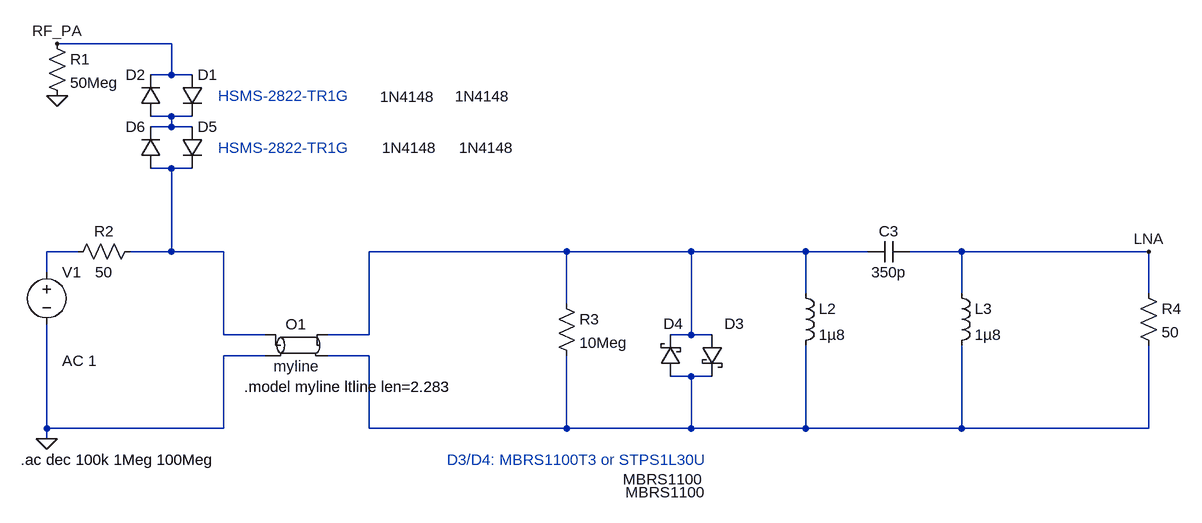
[diagram p0: schematic 22MHz Passive Switch with qL Cable.asc]
22MHz Passive Switch with qL Cable.asc, the LTspice schematic file:
Version 4
SHEET 1 1352 772
WIRE -208 -176 -384 -176
WIRE -208 -128 -208 -176
WIRE -208 -128 -240 -128
WIRE -176 -128 -208 -128
WIRE -208 -64 -240 -64
WIRE -176 -64 -208 -64
WIRE -208 -48 -208 -64
WIRE -208 -48 -240 -48
WIRE -176 -48 -208 -48
WIRE -208 16 -240 16
WIRE -176 16 -208 16
WIRE -352 144 -400 144
WIRE -208 144 -208 16
WIRE -208 144 -272 144
WIRE -128 144 -208 144
WIRE 400 144 96 144
WIRE 592 144 400 144
WIRE 768 144 592 144
WIRE 864 144 768 144
WIRE 1008 144 928 144
WIRE 1296 144 1008 144
WIRE -400 176 -400 144
WIRE 768 208 768 144
WIRE 1008 208 1008 144
WIRE 1296 208 1296 144
WIRE 400 224 400 144
WIRE -128 272 -128 144
WIRE -64 272 -128 272
WIRE 96 272 96 144
WIRE 96 272 32 272
WIRE 592 272 592 144
WIRE 592 272 560 272
WIRE 624 272 592 272
WIRE -64 304 -128 304
WIRE 96 304 32 304
WIRE 592 336 560 336
WIRE 624 336 592 336
WIRE -400 416 -400 256
WIRE -128 416 -128 304
WIRE -128 416 -400 416
WIRE 96 416 96 304
WIRE 400 416 400 304
WIRE 400 416 96 416
WIRE 592 416 592 336
WIRE 592 416 400 416
WIRE 768 416 768 288
WIRE 768 416 592 416
WIRE 1008 416 1008 288
WIRE 1008 416 768 416
WIRE 1296 416 1296 288
WIRE 1296 416 1008 416
WIRE -400 432 -400 416
FLAG -400 432 0
FLAG -384 -176 RF_PA
FLAG -384 -96 0
FLAG 1296 144 LNA
SYMBOL voltage -400 160 R0
WINDOW 123 24 152 Left 2
WINDOW 39 24 124 Left 2
SYMATTR Value2 AC 1
SYMATTR InstName V1
SYMATTR Value ""
SYMBOL res -256 128 R90
WINDOW 0 0 56 VBottom 2
WINDOW 3 32 56 VTop 2
SYMATTR InstName R2
SYMATTR Value 50
SYMBOL res 384 208 R0
SYMATTR InstName R3
SYMATTR Value 10Meg
SYMBOL diode -192 -128 R0
WINDOW 3 305 34 Left 2
SYMATTR Value 1N4148
SYMATTR InstName D1
SYMATTR Description Schottky diode
SYMATTR Type schottky
SYMBOL diode -224 -64 R180
WINDOW 0 24 64 Left 2
WINDOW 3 -537 31 Left 2
SYMATTR InstName D2
SYMATTR Value 1N4148
SYMATTR Description Schottky diode
SYMATTR Type schottky
SYMBOL res -400 -192 R0
SYMATTR InstName R1
SYMATTR Value 50Meg
SYMBOL schottky 608 272 R0
WINDOW 0 35 -17 Left 2
WINDOW 3 -121 222 Left 2
SYMATTR InstName D3
SYMATTR Value MBRS1100
SYMBOL schottky 576 336 R180
WINDOW 0 -4 81 Left 2
WINDOW 3 -38 -178 Left 2
SYMATTR InstName D4
SYMATTR Value MBRS1100
SYMBOL ind 752 192 R0
SYMATTR InstName L2
SYMATTR Value 1µ8
SYMATTR SpiceLine Rser=0.3
SYMBOL ind 992 192 R0
SYMATTR InstName L3
SYMATTR Value 1µ8
SYMATTR SpiceLine Rser=0.3
SYMBOL cap 864 160 R270
WINDOW 0 32 32 VTop 2
WINDOW 3 0 32 VBottom 2
SYMATTR InstName C3
SYMATTR Value 350p
SYMATTR SpiceLine Rser=0.1
SYMBOL res 1280 192 R0
SYMATTR InstName R4
SYMATTR Value 50
SYMBOL diode -192 -48 R0
WINDOW 3 308 32 Left 2
SYMATTR Value 1N4148
SYMATTR InstName D5
SYMATTR Description Schottky diode
SYMATTR Type schottky
SYMBOL diode -224 16 R180
WINDOW 0 24 64 Left 2
WINDOW 3 -543 32 Left 2
SYMATTR InstName D6
SYMATTR Value 1N4148
SYMATTR Description Schottky diode
SYMATTR Type schottky
SYMBOL ltline -16 288 R0
SYMATTR InstName O1
SYMATTR Value myline
TEXT -440 464 Left 2 !.ac dec 100k 1Meg 100Meg
TEXT -136 -96 Left 2 ;HSMS-2822-TR1G
TEXT -136 -16 Left 2 ;HSMS-2822-TR1G
TEXT 216 464 Left 2 ;D3/D4: MBRS1100T3 or STPS1L30U
TEXT -96 352 Left 2 !.model myline ltline len=2.283

The netlist it stands for:
* 22MHz Passive Switch with qL Cable.asc
V1 N003 0 AC 1
R2 N002 N003 50
R3 N004 N005 10Meg
D1 RF_PA N001 1N4148
D2 N001 RF_PA 1N4148
R1 RF_PA 0 50Meg
D3 N004 N005 MBRS1100
D4 N005 N004 MBRS1100
L2 N004 N005 1µ8 Rser=0.3
L3 LNA N005 1µ8 Rser=0.3
C3 N004 LNA 350p Rser=0.1
R4 LNA N005 50
D5 N001 N002 1N4148
D6 N002 N001 1N4148
O1 N002 0 N004 N005 myline
.model D D
.lib standard.dio
.ac dec 100k 1Meg 100Meg
* HSMS-2822-TR1G
* HSMS-2822-TR1G
* D3/D4: MBRS1100T3 or STPS1L30U
.model myline ltline len=2.283
.backanno
.end